# Altium schematic sheet Sheet1.SchDoc
size A3
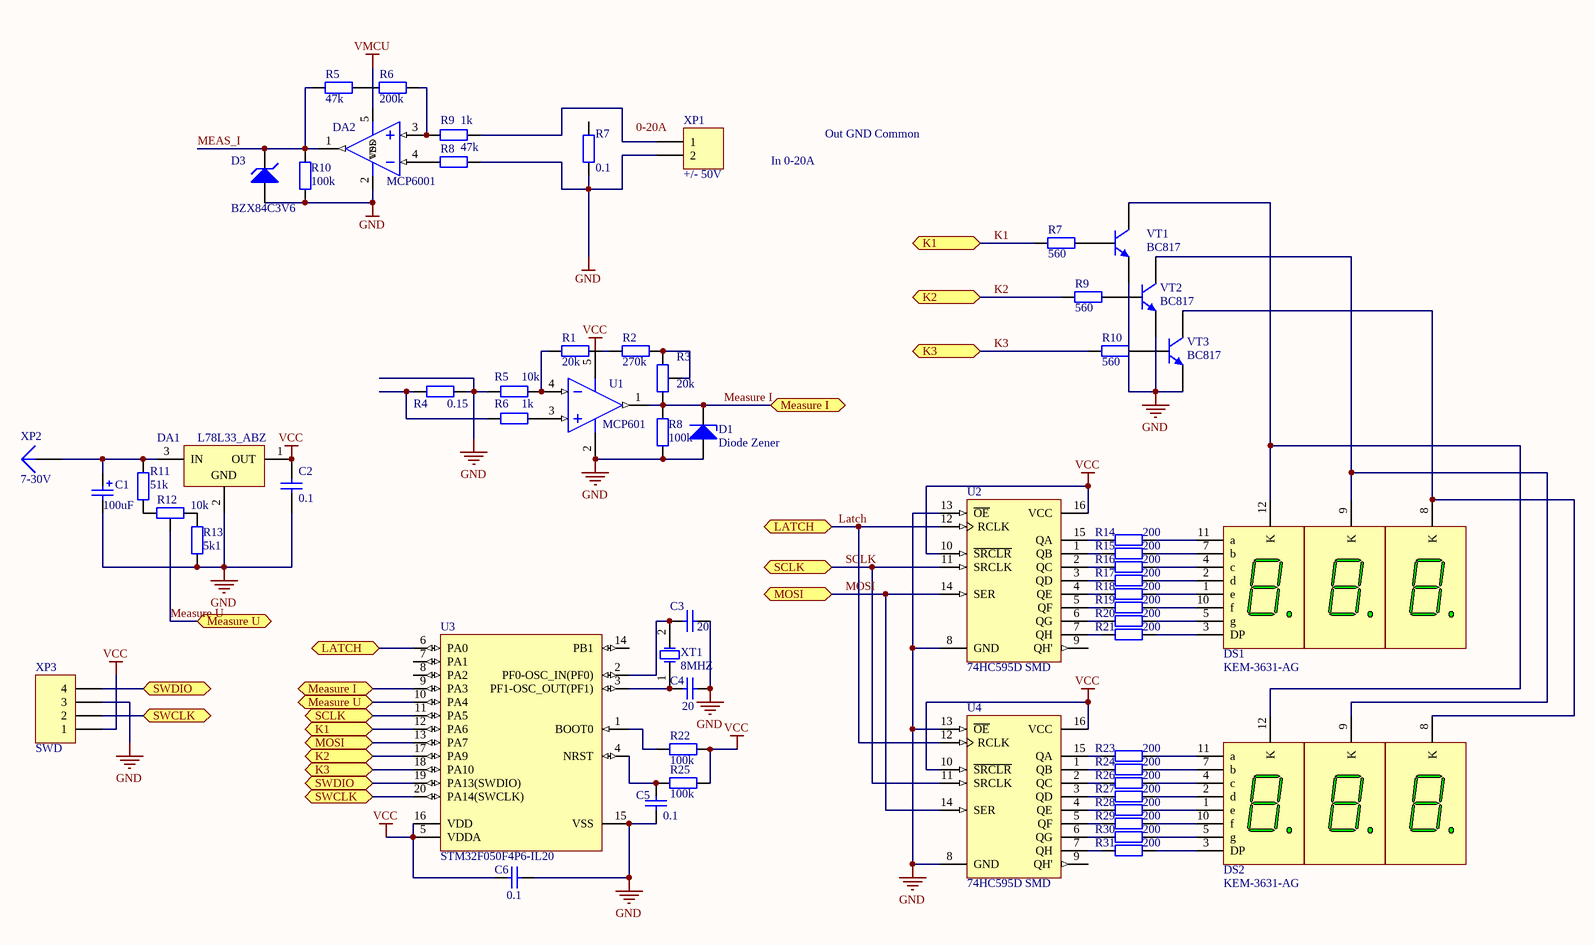
[diagram p0: Sheet1.SchDoc]

## Parts
(Parts that share a designator on the sheet are numbered #1, #2 ... from top to bottom, then left to right.)
C1  100uF  [CAP_DIP_3.5_VERT]
C2  0.1  [CAP 0603_N]
C3  20  [CAP 0603]
C4  20  [CAP 0603]
C5  0.1  [CAP 0603]
C6  0.1  [CAP 0603]
D1  Diode Zener  [SOT23_L]
D3  BZX84C3V6  [SOT-23_L]
DA1  L78L33_ABZ  [TO92]
DA2  MCP6001  [SOT-23-5_L]
DS1  KEM-3631-AG  [KEM-3631-AG]
DS2  KEM-3631-AG  [KEM-3631-AG]
R1  20k  [RES 0603_N]
R2  270k  [RES 0603_N]
R3  20k  [RES VAR 1]
R4  0.15  [AXIAL-0.8]
R5#1  47k  [RES 0603_N]
R5#2  10k  [RES 0603_N]
R6#1  200k  [RES 0603_N]
R6#2  1k  [RES 0603_N]
R7#1  0.1  [RES 2512]
R7#2  560  [RES 0603_N]
R8#1  47k  [RES 0603_N]
R8#2  100k  [RES 0603_N]
R9#1  1k  [RES 0603_N]
R9#2  560  [RES 0603_N]
R10#1  100k  [RES 0603_N]
R10#2  560  [RES 0603_N]
R11  51k  [RES 0603_N]
R12  10k  [RES VAR 1]
R13  5k1  [RES 0603_N]
R14  200  [RES 0603_N]
R15  200  [RES 0603_N]
R16  200  [RES 0603_N]
R17  200  [RES 0603_N]
R18  200  [RES 0603_N]
R19  200  [RES 0603_N]
R20  200  [RES 0603_N]
R21  200  [RES 0603_N]
R22  100k  [RES 0603_N]
R23  200  [RES 0603_N]
R24  200  [RES 0603_N]
R25  100k  [RES 0603_N]
R26  200  [RES 0603_N]
R27  200  [RES 0603_N]
R28  200  [RES 0603_N]
R29  200  [RES 0603_N]
R30  200  [RES 0603_N]
R31  200  [RES 0603_N]
U1  MCP601  [SOT23-5_L]
U2  74HC595D SMD  [SOIC16_L]
U3  STM32F050F4P6-IL20  [TSSOP20_N]
U4  74HC595D SMD  [SOIC16_N]
VT1  BC817  [SOT23_L]
VT2  BC817  [SOT23_L]
VT3  BC817  [SOT23_L]
XP1  +/- 50V  [con_1X2_5.08]
XP2  7-30V  [Con_PIN1]
XP3  SWD  [Con_1X4]
XT1  8MHZ  [XTALL_SMD_M]

## Ports
K1, K2, K3, LATCH, Measure I, Measure U, MOSI, SCLK, SWCLK, SWDIO

## Nets
GND: C1.2 C2.1 C3.2 C4.2 C5.2 C6.2 D1.1(A) D3.1(A) DA1.2(GND) DA2.2(VSS) R4.2 R5#2.1 R7#1.1 R8#1.1 R8#2.1 R10#1.1 R13.2 U1.2(VSS) U2.8(GND) U2.13(~{OE}) U3.15(VSS) U4.8(GND) U4.13(~{OE}) VT1.2(E) VT2.2(E) VT3.2(E) XP1.2 XP3.3
VCC: C2.2 C6.1 DA1.1(OUT) R22.1 R25.1 U1.5(VDD) U2.10(~{SRCLR}) U2.16(VCC) U3.5(VDDA) U3.16(VDD) U4.10(~{SRCLR}) U4.16(VCC) XP3.1
VMCU: DA2.5(VDD)
K1: R7#2.1 U3.12(PA6) ; port K1
K2: R9#2.1 U3.17(PA9) ; port K2
K3: R10#2.1 U3.18(PA10) ; port K3
Latch: U2.12(RCLK) U3.6(PA0) U4.12(RCLK) ; port LATCH
MEAS_I: D3.3(K) DA2.1(VOUT) R5#1.2 R10#1.2
Measure I: D1.3(K) R3.3(B) R8#2.2 U1.1(VOUT) U3.9(PA3) ; port Measure I
Measure U: R12.2(TAP) U3.10(PA4) ; port Measure U
MOSI: U2.14(SER) U3.13(PA7) U4.14(SER) ; port MOSI
SCLK: U2.11(SRCLK) U3.11(PA5) U4.11(SRCLK) ; port SCLK
SWCLK: U3.20(PA14(SWCLK)) XP3.2 ; port SWCLK
SWDIO: U3.19(PA13(SWDIO)) XP3.4 ; port SWDIO
NetC1_1: C1.1 DA1.3(IN) R11.2 XP2.1
NetC3_1: C3.1 U3.2(PF0-OSC_IN(PF0)) XT1.2(OSC2)
NetC4_1: C4.1 U3.3(PF1-OSC_OUT(PF1)) XT1.1(OSC1)
NetC5_1: C5.1 R25.2 U3.4(NRST)
NetDA2_3: DA2.3(VIN+) R6#1.1 R9#1.2
NetDA2_4: DA2.4(VIN-) R8#1.2
NetDS1_1: DS1.1(e) R18.2
NetDS1_2: DS1.2(d) R17.2
NetDS1_3: DS1.3(DP) R21.2
NetDS1_4: DS1.4(c) R16.2
NetDS1_5: DS1.5(g) R20.2
NetDS1_7: DS1.7(b) R15.2
NetDS1_8: DS1.8(K) DS2.8(K) VT3.3(C)
NetDS1_9: DS1.9(K) DS2.9(K) VT2.3(C)
NetDS1_10: DS1.10(f) R19.2
NetDS1_11: DS1.11(a) R14.2
NetDS1_12: DS1.12(K) DS2.12(K) VT1.3(C)
NetDS2_1: DS2.1(e) R28.2
NetDS2_2: DS2.2(d) R27.2
NetDS2_3: DS2.3(DP) R31.2
NetDS2_4: DS2.4(c) R26.2
NetDS2_5: DS2.5(g) R30.2
NetDS2_7: DS2.7(b) R24.2
NetDS2_10: DS2.10(f) R29.2
NetDS2_11: DS2.11(a) R23.2
NetR1_1: R1.1 R5#2.2 U1.4(VIN-)
NetR1_2: R1.2 R2.1
NetR2_2: R2.2 R3.1(A) R3.2(TAP)
NetR4_1: R4.1 R6#2.1
NetR5#1_1: R5#1.1 R6#1.2
NetR6#2_2: R6#2.2 U1.3(VIN+)
NetR7#2_2: R7#2.2 VT1.1(B)
NetR9#1_1: R9#1.1 XP1.1
NetR9#2_2: R9#2.2 VT2.1(B)
NetR10#2_2: R10#2.2 VT3.1(B)
NetR11_1: R11.1 R12.3(B)
NetR12_1: R12.1(A) R13.1
NetR14_1: R14.1 U2.15(QA)
NetR15_1: R15.1 U2.1(QB)
NetR16_1: R16.1 U2.2(QC)
NetR17_1: R17.1 U2.3(QD)
NetR18_1: R18.1 U2.4(QE)
NetR19_1: R19.1 U2.5(QF)
NetR20_1: R20.1 U2.6(QG)
NetR21_1: R21.1 U2.7(QH)
NetR22_2: R22.2 U3.1(BOOT0)
NetR23_1: R23.1 U4.15(QA)
NetR24_1: R24.1 U4.1(QB)
NetR26_1: R26.1 U4.2(QC)
NetR27_1: R27.1 U4.3(QD)
NetR28_1: R28.1 U4.4(QE)
NetR29_1: R29.1 U4.5(QF)
NetR30_1: R30.1 U4.6(QG)
NetR31_1: R31.1 U4.7(QH)

Not connected (* = marked no-connect by the designer): R7#1 2; U2 9(QH'); U3 7(PA1) 8(PA2) 14(PB1); U4 9(QH')

## Notes on the sheet
- (near XP1) In 0-20A
- Out GND Common
- Labels drawn without touching a wire or pin: 0-20A

## Library data of the parts
C1 = Capacitor_DIP
C2 = CAP_SMD: Capacitor SMD
C3-C6 = Capacitor_SMD
D1 = Diode Zener: Zener Diode; Published: 8-Jun-2000; LatestRevisionDate: 17-Jul-2002; LatestRevisionNote: Re-released for DXP Platform.; PackageReference: DIODE-0.7; Publisher: Altium Limited; PackageDescription: Diode, Thru-Hole; 2 Leads; 0.7 in Pin Spacing
D3 = BZX84: Zener Diode; Published: 8-Jun-2000; LatestRevisionDate: 17-Jul-2002; LatestRevisionNote: Re-released for DXP Platform.; PackageReference: DIODE-0.7; Publisher: Altium Limited; PackageDescription: Diode, Thru-Hole; 2 Leads; 0.7 in Pin Spacing
DA1 = L78L33_ABZ: Positive Voltage Regulator; Published: 24-Aug-2001; LatestRevisionDate: 17-Jul-2002; LatestRevisionNote: Re-released for DXP Platform.; DatasheetVersion: Feb-1999; PackageReference: TO92; Publisher: Altium Limited; PackageDescription: TO, Flat Index; 3 In-Line, Axial Leads; Body Dia. 4.8mm; Leads 0.51 x 0.51 mm (max); ComponentLink1Description: Manufacturer Link; ComponentLink1URL: http://www.st.com/
DA2 = MCP6001: 1 MHz, Low-Power Op Amp
DS1 DS2 = KEM-3631-AG: 7.62 mm Black Surface Green 7-Segment Display: CC, RH DP; MinimumIntensity: 860 ucd; Note: IF = 10 mA; Note: Pins 1 and 6 are redundant Cathodes.; Published: 8-Jun-2000; LatestRevisionDate: 17-Dec-2003; LatestRevisionNote: Schematic revised, PCB Footprint replaced.; DatasheetVersion: 19-Feb-2002; PackageVersion: 11-Feb-2002; PackageReference: A; Publisher: Altium Limited; PackageDescription: LED, 7-Segment Display, 7.62 mm, RHD; 10 Leads; Row Space 5.08 mm; Pitch 2.54 mm; Colour: Green; ComponentLink1Description: Manufacturer Link; ComponentLink1URL: http://www.agilent.com/
R1 R2 R5#1 R5#2 R6#1 R6#2 R7#2 R8#1 R8#2 R9#1 R9#2 R10#1 R10#2 R11 R13-R31 = Resistor_SMD
R3 R12 = Res Tap: Tapped Resistor; Sim Note: Enter the Resistance value and the set point into parameter fields.; Set Position: 0.5; Published: 24-Mar-1999; LatestRevisionDate: 17-Jul-2002; LatestRevisionNote: Re-released for DXP Platform.; PackageReference: VR3; Publisher: Altium Limited; PackageDescription: Variable Resistor, Thru-Hole; 3 Leads
R4 = Res2: Resistor; Published: 8-Jun-2000; LatestRevisionDate: 17-Jul-2002; LatestRevisionNote: Re-released for DXP Platform.; PackageReference: AXIAL-0.4; Publisher: Altium Limited; PackageDescription: Axial Device, Thru-Hole; 2 Leads; 0.4 in Pin Spacing
R7#1 = RES_SMD: Resistor
U1 = MCP601: Operation amplifier, 2.7V to 2.6V, Single Supply
U2 U4 = 74HC595D SMD: 8-Bit Shift Register with 3-State Output Registers; Published: 8-Jun-2000; LatestRevisionDate: 13-Apr-2006; LatestRevisionNote: IPC-7351 Footprint Added.; DatasheetVersion: May-1997; PackageVersion: Jan-1998; PackageReference: D016; Publisher: Altium Limited; PackageDescription: 16-Pin Small Outline Integrated Circuit 1.27 mm Pitch; Code_IPC: SOIC127P600-16; ComponentLink1Description: Manufacturer Link; ComponentLink1URL: http://www.ti.com/; ComponentLink2Description: Datasheet; ComponentLink2URL: http://www-s.ti.com/sc/ds/sn74hc595.pdf
VT1-VT3 = BC817: NPN General-purpose Transistor
XP1 = Connectors_1x2_PIN: Header, 2-Pin; LatestRevisionDate: 17-Jul-2002; LatestRevisionNote: Re-released for DXP Platform.; Publisher: Altium Limited
XP2 = Connectors_1x1_PIN: Plug papa; LatestRevisionDate: 17-Jul-2002; LatestRevisionNote: Re-released for DXP Platform.; Publisher: Altium Limited
XP3 = Connectors_1x4_PIN: Header, 4-Pin; LatestRevisionDate: 17-Jul-2002; LatestRevisionNote: Re-released for DXP Platform.; Publisher: Altium Limited
XT1 = XTAL: Crystal Oscillator; Published: 8-Jun-2000; LatestRevisionDate: 17-Jul-2002; LatestRevisionNote: Re-released for DXP Platform.; PackageReference: R38; Publisher: Altium Limited; PackageDescription: Crystal, Thru-Hole; 2 Leads; Body 3.1 x 8.2 mm (Dia.xH)